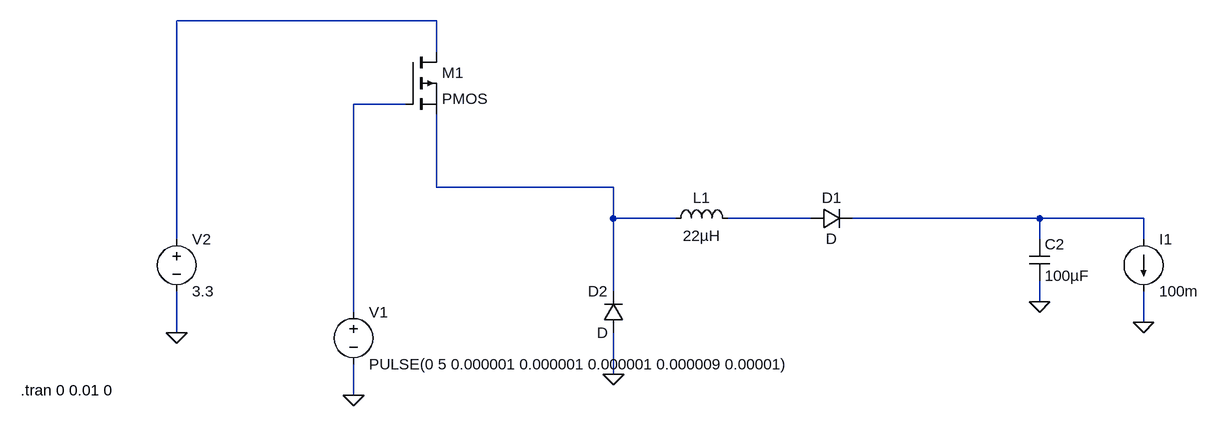
[diagram p0: schematic Buck.asc]
Buck.asc, the LTspice schematic file:
Version 4
SHEET 1 1192 680
WIRE -304 -528 -704 -528
WIRE -304 -480 -304 -528
WIRE -352 -400 -432 -400
WIRE -304 -272 -304 -384
WIRE -32 -272 -304 -272
WIRE -32 -224 -32 -272
WIRE 64 -224 -32 -224
WIRE 272 -224 144 -224
WIRE 624 -224 336 -224
WIRE 784 -224 624 -224
WIRE -704 -192 -704 -528
WIRE 624 -192 624 -224
WIRE 784 -192 784 -224
WIRE -32 -112 -32 -224
WIRE 624 -96 624 -128
WIRE -432 -80 -432 -400
WIRE 784 -64 784 -112
WIRE -704 -48 -704 -112
WIRE -32 16 -32 -48
WIRE -432 48 -432 0
FLAG -704 -48 0
FLAG 624 -96 0
FLAG 784 -64 0
FLAG -32 16 0
FLAG -432 48 0
SYMBOL voltage -704 -208 R0
WINDOW 123 0 0 Left 2
WINDOW 39 0 0 Left 2
SYMATTR InstName V2
SYMATTR Value 3.3
SYMBOL ind 48 -208 R270
WINDOW 0 32 56 VTop 2
WINDOW 3 5 56 VBottom 2
SYMATTR InstName L1
SYMATTR Value 22µH
SYMBOL diode 272 -208 R270
WINDOW 0 32 32 VTop 2
WINDOW 3 0 32 VBottom 2
SYMATTR InstName D1
SYMBOL cap 608 -192 R0
SYMATTR InstName C2
SYMATTR Value 100µF
SYMBOL current 784 -192 R0
WINDOW 123 0 0 Left 2
WINDOW 39 0 0 Left 2
SYMATTR InstName I1
SYMATTR Value 100m
SYMBOL diode -16 -48 R180
WINDOW 0 24 64 Left 2
WINDOW 3 24 0 Left 2
SYMATTR InstName D2
SYMBOL voltage -432 -96 R0
WINDOW 123 0 0 Left 2
WINDOW 39 0 0 Left 2
SYMATTR InstName V1
SYMATTR Value PULSE(0 5 0.000001 0.000001 0.000001 0.000009 0.00001)
SYMBOL pmos -352 -480 R0
SYMATTR InstName M1
TEXT -944 40 Left 2 !.tran 0 0.01 0

The netlist it stands for:
* Buck.asc
V2 N001 0 3.3
L1 N003 N004 22µH
D1 N004 N005 D
C2 N005 0 100µF
I1 N005 0 100m
D2 0 N003 D
V1 N002 0 PULSE(0 5 0.000001 0.000001 0.000001 0.000009 0.00001)
M1 N001 N002 N003 N003 PMOS
.model D D
.lib standard.dio
.model NMOS NMOS
.model PMOS PMOS
.lib standard.mos
.tran 0 0.01 0
.backanno
.end